# EAGLE schematic arduinosnull (EAGLE 7.2.0)
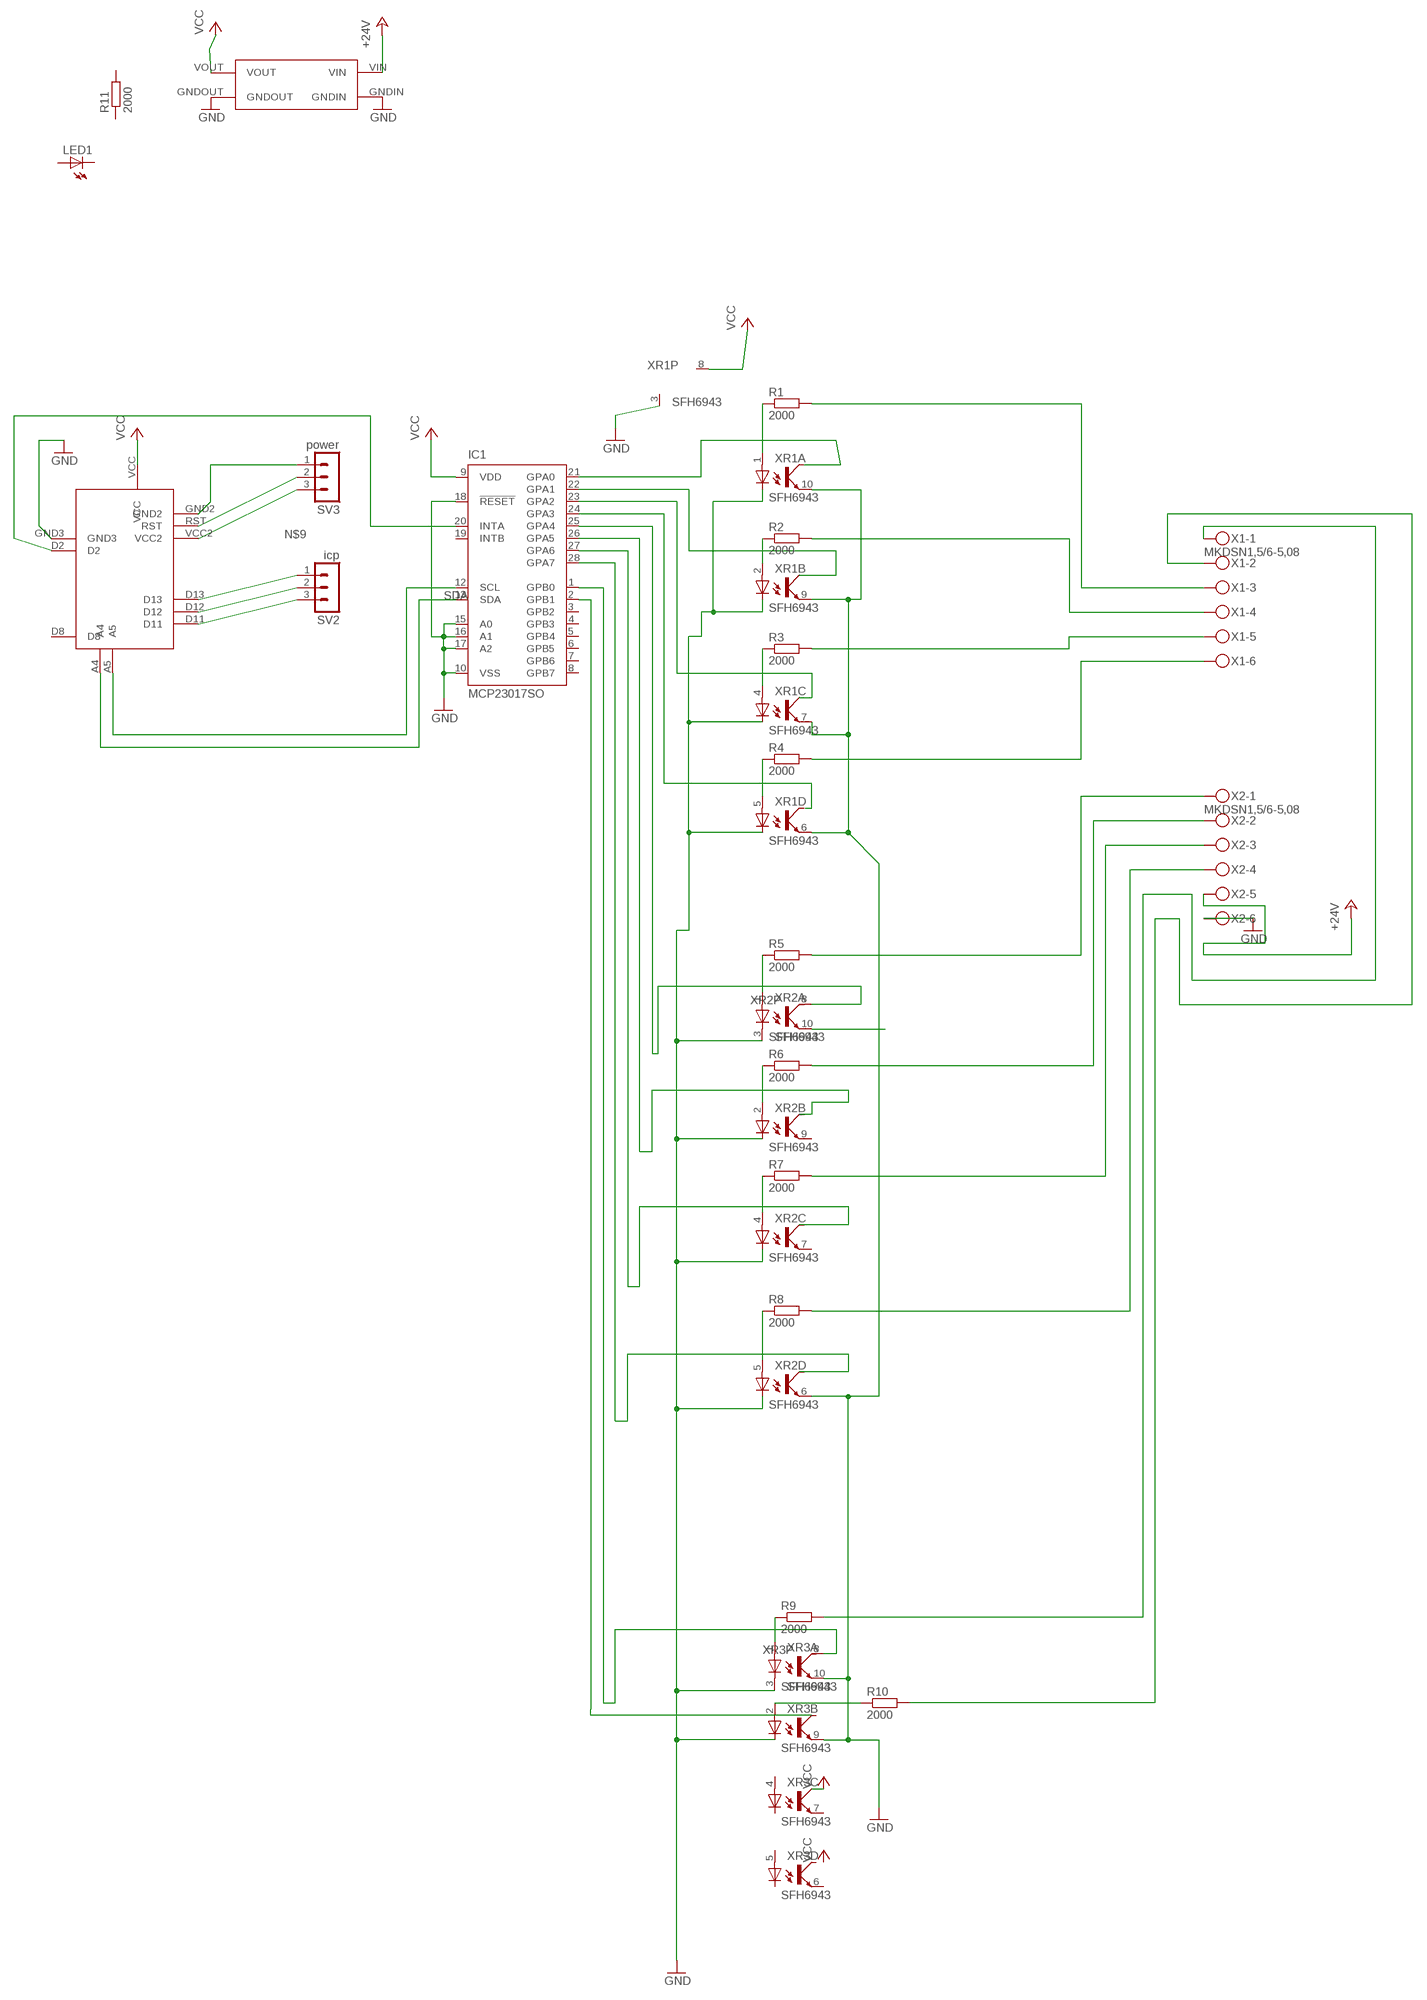
[diagram p0: schematic, sheet 1]

## Parts
IC1  MCP23017SO  [SO28W]
LED1  LEDSML0805  [SML0805]
R1  2000  R-EU_M0805  [M0805]
R2  2000  R-EU_M0805  [M0805]
R3  2000  R-EU_M0805  [M0805]
R4  2000  R-EU_M0805  [M0805]
R5  2000  R-EU_M0805  [M0805]
R6  2000  R-EU_M0805  [M0805]
R7  2000  R-EU_M0805  [M0805]
R8  2000  R-EU_M0805  [M0805]
R9  2000  R-EU_M0805  [M0805]
R10  2000  R-EU_M0805  [M0805]
R11  2000  R-EU_M0805  [M0805]
SV2  icp  MA03-1  [MA03-1]
SV3  power  MA03-1  [MA03-1]
U$1  ARDUINOPROMINIREDUCED  [ARDUINOPROMINIREDUCED]
U$2  VREGMODULE  [VREGMODULE]
X1  MKDSN1,5/6-5,08  [MKDSN1,5/6-5,08]
X2  MKDSN1,5/6-5,08  [MKDSN1,5/6-5,08]
XR1  SFH6943  [SOT223/10]
XR2  SFH6943  [SOT223/10]
XR3  SFH6943  [SOT223/10]

## Nets
+24V: U$2.VIN X2.5
GND: IC1.10(VSS) IC1.15(A0) IC1.16(A1) IC1.17(A2) IC1.18(!RESET) U$1.GND3 U$2.GNDIN U$2.GNDOUT X2.6 XR1.3(P:COM-CAT) XR1.6(D:EMI) XR1.7(C:EMI) XR1.9(B:EMI) XR1.10(A:EMI) XR2.3(P:COM-CAT) XR2.6(D:EMI) XR3.3(P:COM-CAT) XR3.9(B:EMI) XR3.10(A:EMI)
N$1: IC1.21(GPA0)
N$2: IC1.23(GPA2)
N$3: R1.1 XR1.1(A:A)
N$4: R1.2 X1.3
N$5: R2.1 XR1.2(B:A)
N$6: R3.1 XR1.4(C:A)
N$7: R4.1 XR1.5(D:A)
N$8: R2.2 X1.4
N$9: SV3.3 U$1.VCC2
N$10: XR2.10(A:EMI)
N$11: R3.2 X1.5
N$12: R4.2 X1.6
N$13: IC1.24(GPA3)
N$14: SV2.3 U$1.D11
N$15: SV2.2 U$1.D12
N$16: SV2.1 U$1.D13
N$17: R5.1 XR2.1(A:A)
N$18: R6.1 XR2.2(B:A)
N$19: R7.1 XR2.4(C:A)
N$20: R8.1 XR2.5(D:A)
N$21: IC1.25(GPA4) XR2.8(P:COM-COL)
N$22: R5.2 X2.1
N$23: R6.2 X2.2
N$24: IC1.26(GPA5)
N$25: R7.2 X2.3
N$26: R8.2 X2.4
N$28: IC1.27(GPA6)
N$29: R9.2 X1.1
N$30: R9.1 XR3.1(A:A)
N$31: IC1.1(GPB0) XR3.8(P:COM-COL)
N$32: IC1.2(GPB1)
N$33: R10.1 XR3.2(B:A)
N$34: R10.2 X1.2
N$35: IC1.12(SCL) U$1.A5
N$36: IC1.20(INTA) U$1.D2
N$37: SV3.2 U$1.RST
N$38: SV3.1 U$1.GND2
N$40: IC1.22(GPA1)
N$46: IC1.28(GPA7)
SDA: IC1.13(SDA) U$1.A4
VCC: IC1.9(VDD) U$1.VCC U$2.VOUT XR1.8(P:COM-COL)
Unconnected: IC1.3(GPB2) IC1.4(GPB3) IC1.5(GPB4) IC1.6(GPB5) IC1.7(GPB6) IC1.8(GPB7) IC1.19(INTB) LED1.A LED1.C R11.1 R11.2 U$1.D8 XR2.7(C:EMI) XR2.9(B:EMI) XR3.4(C:A) XR3.5(D:A) XR3.6(D:EMI) XR3.7(C:EMI)

## Library data of the parts
IC1 = microchip:MCP23017: http://ww1.microchip.com/downloads/en/DeviceDoc/21952a.pdf Source: http://ww1.microchip.com/downloads/en/DeviceDoc/21952a.pdf; MF: MICROCHIP; MPN: MCP23017-E/SO; OC_FARNELL: 1332087; OC_NEWARK: 31K2958
LED1 = led:LED: LED OSRAM: - CHIPLED LG R971, LG N971, LY N971, LG Q971, LY Q971, LO R971, LY R971 LH N974, LH R974 LS Q976, LO Q976, LY Q976 LO Q996 - Hyper CHIPLED LW Q18S LB Q993, LB Q99A, LB R99A - SideLED LS A670, LO A670, LY A670, LG A670, LP A670 LB A673, LV A673, LT A673, LW A673 LH A674 LY A675 LS A676, LA A676, LO A676, LY A676, LW A676 LS A679, LY A679, LG A679 - Hyper Micro SIDELED® LS Y876, LA Y876, LO Y876, LY Y876 LT Y87S - SmartLED LW L88C, LW L88S LB L89C, LB L89S, LG L890 LS L89K, LO L89K, LY L89K LS L896, LA L896, LO L896, LY L896 - TOPLED LS T670, LO T670, LY T670, LG T670, LP T670 LSG T670, LSP T670, LSY T670, LOP T670, LYG T670 LG T671, LOG T671, LSG T671 LB T673, LV T673, LT T673, LW T673 LH T674 LS T676, LA T676, LO T676, LY T676, LB T676, LH T676, LSB T676, LW T676 LB T67C, LV T67C, LT T67C, LS T67K, LO T67K, LY T67K, LW E67C LS E67B, LA E67B, LO E67B, LY E67B, LB E67C, LV E67C, LT E67C LW T67C LS T679, LY T679, LG T679 LS T770, LO T770, LY T770, LG T770, LP T770 LB T773, LV T773, LT T773, LW T773 LH T774 LS E675, LA E675, LY E675, LS T675 LS T776, LA T776, LO T776, LY T776, LB T776 LHGB T686 LT T68C, LB T68C - Hyper Mini TOPLED® LB M676 - Mini TOPLED Santana® LG M470 LS M47K, LO M47K, LY M47K Source: http://www.osram.convergy.de LUXEON: - LUMILED® LXK2-PW12-R00, LXK2-PW12-S00, LXK2-PW14-U00, LXK2-PW14-V00 LXK2-PM12-R00, LXK2-PM12-S00, LXK2-PM14-U00 LXK2-PE12-Q00, LXK2-PE12-R00, LXK2-PE12-S00, LXK2-PE14-T00, LXK2-PE14-U00 LXK2-PB12-K00, LXK2-PB12-L00, LXK2-PB12-M00, LXK2-PB14-N00, LXK2-PB14-P00, LXK2-PB14-Q00 LXK2-PR12-L00, LXK2-PR12-M00, LXK2-PR14-Q00, LXK2-PR14-R00 LXK2-PD12-Q00, LXK2-PD12-R00, LXK2-PD12-S00 LXK2-PH12-R00, LXK2-PH12-S00 LXK2-PL12-P00, LXK2-PL12-Q00, LXK2-PL12-R00 Source: www.luxeon.com KINGBRIGHT: KA-3528ASYC Source: www.kingbright.com
R1-R11 = rcl:R-EU_: RESISTOR, European symbol
SV2 SV3 = con-lstb:MA03-1: PIN HEADER; OC_FARNELL: unknown; OC_NEWARK: unknown
U$1 = snulllib:ARDUINOPROMINIREDUCED
U$2 = snulllib:VREGMODULE
X1 X2 = con-phoenix-508:MKDSN1,5/6-5,08: MKDSN 1,5/ 6-5,08 Printklemme Nennstrom: 13,5 A Nennspannung: 250 V Rastermaß: 5,08 mm Polzahl: 6 Anschlussart: Schraubanschluss Montage: Löten Anschlussrichtung Leiter/Platine: 0 ° Artikelnummer: 1729160 Source: http://eshop.phoenixcontact.com .. 1729160.pdf
XR1-XR3 = opto-vishay:SFH6943: Optocoupler, Phototransistor Output Quad Channel Source: http://www.vishay.com/docs/83688/83688.pdf; MPN: SFH6943A-4T; OC_FARNELL: 1045530; OC_NEWARK: 66M1324